# EAGLE schematic BNC Shield +:-0.1-0.8 (EAGLE 6.3)
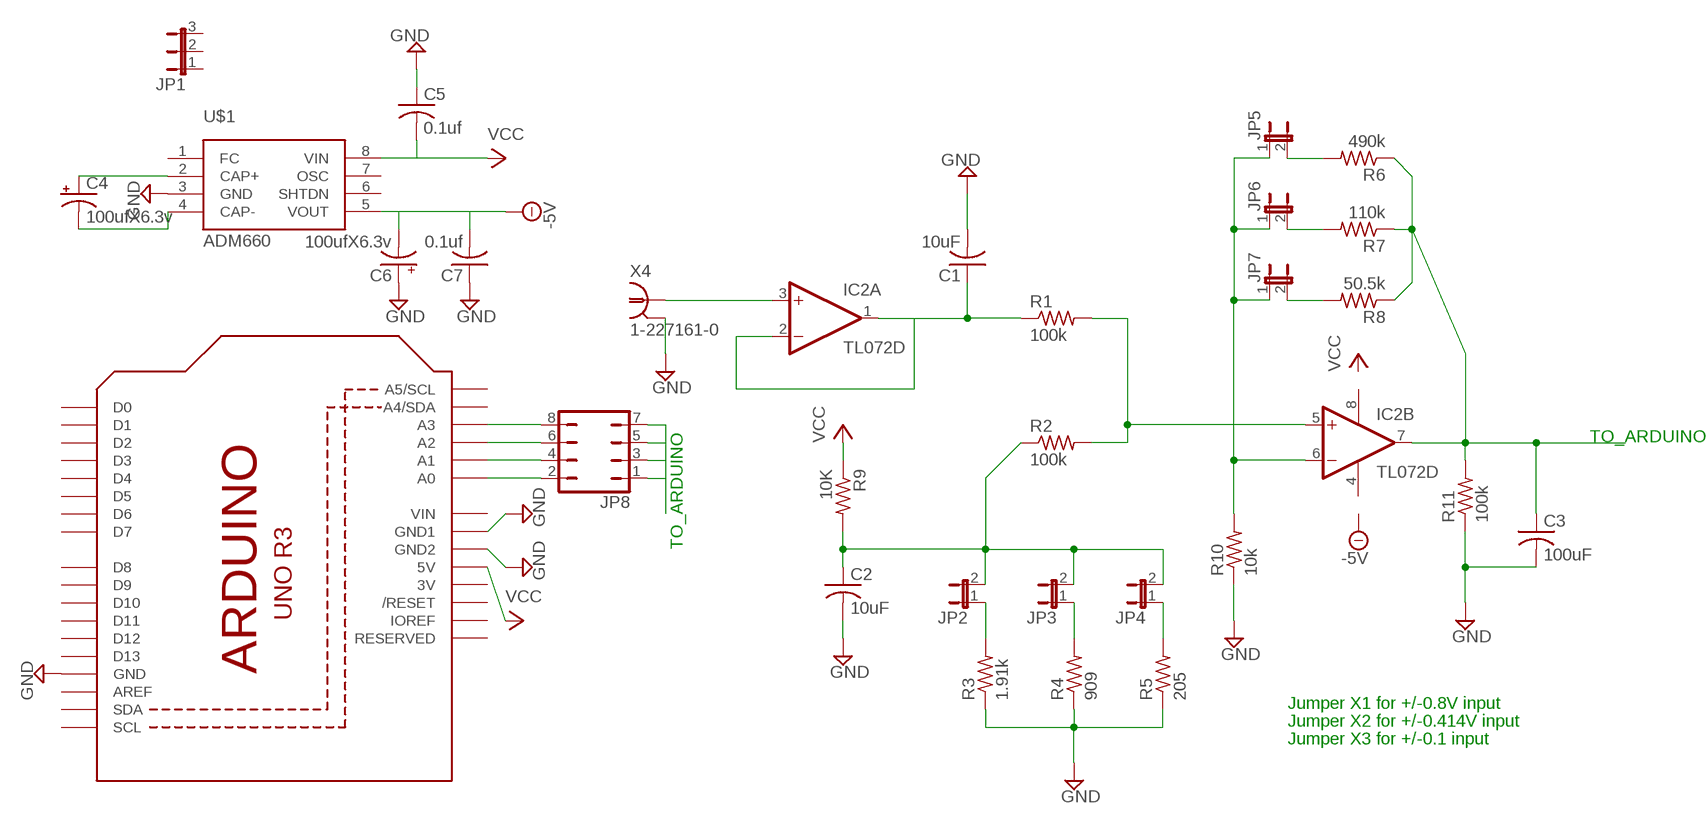
[diagram p0: schematic, sheet 1]

## Parts
C1  10uF  C-USC0603  [C0603]
C2  10uF  C-USC0603  [C0603]
C3  100uF  C-USC0603  [C0603]
C4  100ufX6.3v  CPOL-US153CLV-0605  [153CLV-0605]
C5  0.1uf  C-USC0603  [C0603]
C6  100ufX6.3v  CPOL-US153CLV-0605  [153CLV-0605]
C7  0.1uf  C-USC0603  [C0603]
IC2  TL072D  [SO08]
JP1  JP2E  [JP2]
JP2  JP1E  [JP1]
JP3  JP1E  [JP1]
JP4  JP1E  [JP1]
JP5  JP1E  [JP1]
JP6  JP1E  [JP1]
JP7  JP1E  [JP1]
JP8  JP4Q  [JP4Q]
R1  100k  R-US_R0603  [R0603]
R2  100k  R-US_R0603  [R0603]
R3  1.91k  R-US_R0603  [R0603]
R4  909  R-US_R0603  [R0603]
R5  205  R-US_R0603  [R0603]
R6  490k  R-US_R0603  [R0603]
R7  110k  R-US_R0603  [R0603]
R8  50.5k  R-US_R0603  [R0603]
R9  10K  R-US_R0603  [R0603]
R10  10k  R-US_R0603  [R0603]
R11  100k  R-US_R0603  [R0603]
U1  ARDUINOR3-DIMENSION  [ARDUINOR3]
U$1  ADM660  TC1121COA  [SO8]
X4  1-227161-0  [AMP_227161]

## Nets
-5V: C6.- C7.2 U$1.5(VOUT)
GND: C1.2 C2.2 C3.2 C5.1 C6.+ C7.1 R3.1 R4.1 R5.1 R10.1 R11.1 U1.GND U1.GND1 U1.GND2 U$1.3(GND) X4.2(GND)
N$1: C1.1 IC2.1(A:OUT) IC2.2(A:-IN) R1.1
N$2: JP2.1 R3.2
N$3: JP3.1 R4.2
N$4: JP4.1 R5.2
N$5: IC2.5(B:+IN) R1.2 R2.2
N$6: C2.1 JP2.2 JP3.2 JP4.2 R2.1 R9.2
N$7: JP5.2 R6.2
N$8: JP6.2 R7.2
N$9: JP7.2 R8.2
N$10: C4.+ U$1.2(CAP+)
N$11: IC2.6(B:-IN) JP5.1 JP6.1 JP7.1 R10.2
N$12: IC2.3(A:+IN) X4.1
N$13: JP8.2 U1.A0
N$14: JP8.4 U1.A1
N$15: JP8.6 U1.A2
N$16: JP8.8 U1.A3
N$17: C4.- U$1.4(CAP-)
TO_ARDUINO: C3.1 IC2.7(B:OUT) JP8.1 JP8.3 JP8.5 JP8.7 R6.1 R7.1 R8.1 R11.2
VCC: C5.2 R9.1 U1.5V U$1.8(VIN)
Unconnected: JP1.1 JP1.2 JP1.3 U1.A4(A4/SDA) U1.A5(A5/SCL) U1.AREF U1.D0 U1.D1 U1.D2 U1.D3 U1.D4 U1.D5 U1.D6 U1.D7 U1.D8 U1.D9 U1.D10 U1.D11 U1.D12 U1.D13 U1.IOREF U1.RESERVED U1.RESET(/RESET) U1.SCL U1.SDA U$1.1(FC) U$1.6(SHTDN) U$1.7(OSC)

## Notes on the sheet
- TO_ARDUINO
- TO_ARDUINO
- Jumper X1 for +/-0.8V input
- Jumper X2 for +/-0.414V input
- Jumper X3 for +/-0.1 input

## Power pins joined to a net without a drawn wire
3V: U1.3V
V+: IC2.8(P:V+)
V-: IC2.4(P:V-)
VIN: U1.VIN

## Library data of the parts
C1-C3 = resistor:C-US: CAPACITOR, American symbol
C4 C6 = adafruit:CPOL-US: POLARIZED CAPACITOR, American symbol
C5 C7 = adafruit:C-US: CAPACITOR, American symbol
IC2 = linear:TL072: OP AMP
JP1 = jumper:JP2E: JUMPER
JP2-JP7 = jumper:JP1E: JUMPER
JP8 = jumper:JP4Q: JUMPER
R1-R11 = resistor:R-US_: RESISTOR, American symbol
U1 = adafruit:ARDUINOR3: This is a new object for the new Arduino R3 - with extra pins that you may want to use (such as IOref, and duplicated A4/A5
U$1 = tc1121:TC1121: Microchip - 100mA charge pump voltage converter with shutdown. It converts a 2.4V to 5.5V to a corresponding negative output voltage.
X4 = con-coax:?227161*: JACK, RIGHT ANGLE, 50 OHM, PCB, BNC Source: amp_227161.pdf; MF: TYCO ELECTRONICS; MPN: 1-227161; OC_FARNELL: unknown; OC_NEWARK: 33B3200